# EAGLE design Arduinp-Shield-MicroPunch (EAGLE 9.5.2)
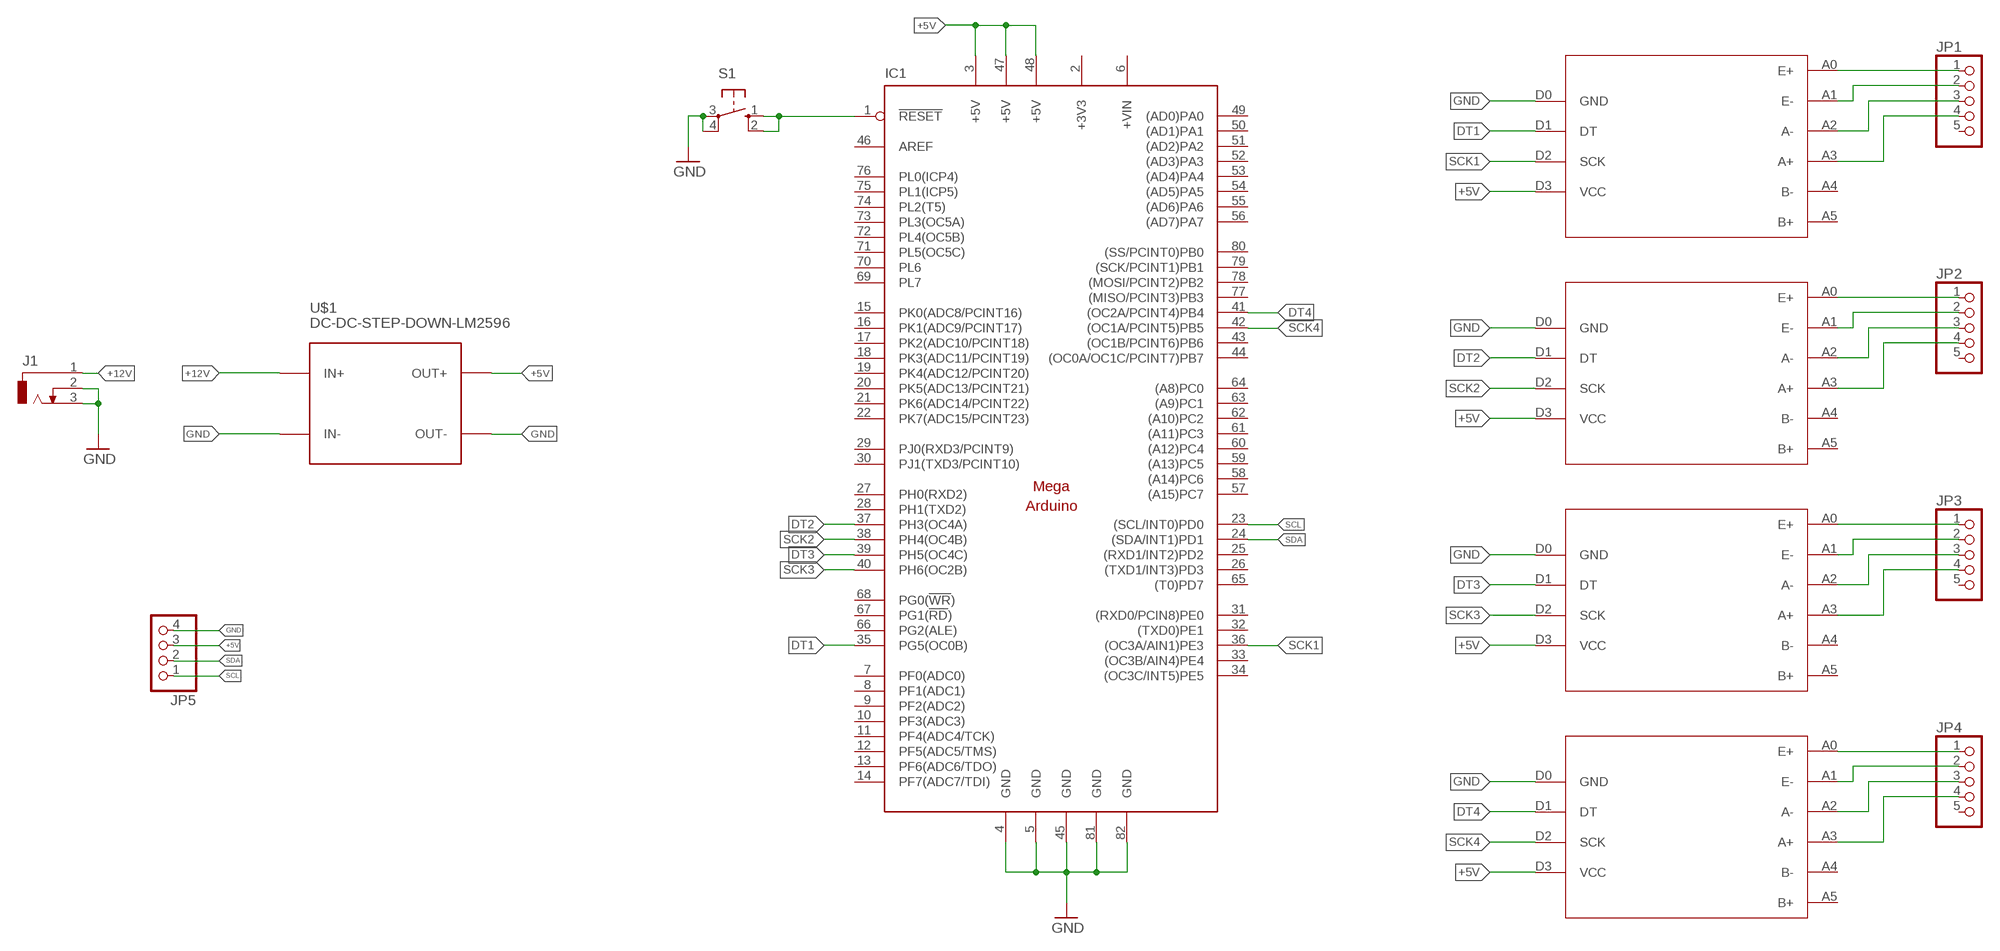
[diagram p0: schematic, sheet 1]

## Parts
IC1  MEGAARDUINO_11  [MEGA_ARDUINO_1]
J1  DCJ0303  [DCJ0303]
JP1  PINHD-1X5  [1X05]
JP2  PINHD-1X5  [1X05]
JP3  PINHD-1X5  [1X05]
JP4  PINHD-1X5  [1X05]
JP5  PINHD-1X4  [1X04]
S1  10-XX  [B3F-10XX]
SM1  HX711  [HX711]
SM2  HX711  [HX711]
SM3  HX711  [HX711]
SM4  HX711  [HX711]
U$1  DC-DC-STEP-DOWN-LM2596  [DC-DC-STEP-DOWN-LM2596]

## Nets
+5V: IC1.3(+5V) IC1.47(+5V) IC1.48(+5V) JP5.3 SM1.D3(VCC) SM2.D3(VCC) SM3.D3(VCC) SM4.D3(VCC) U$1.OUT+
+12V: J1.1 U$1.IN+
DT1: IC1.35(PG5(OC0B)) SM1.D1(DT)
DT2: IC1.37(PH3(OC4A)) SM2.D1(DT)
DT3: IC1.39(PH5(OC4C)) SM3.D1(DT)
DT4: IC1.41((OC2A/PCINT4)PB4) SM4.D1(DT)
GND: IC1.4(GND) IC1.5(GND) IC1.45(GND) IC1.81(GND) IC1.82(GND) J1.2 J1.3 JP5.4 S1.3(P) S1.4(P1) SM1.D0(GND) SM2.D0(GND) SM3.D0(GND) SM4.D0(GND) U$1.IN- U$1.OUT-
N$1: IC1.1(!RESET) S1.1(S) S1.2(S1)
N$17: JP4.1 SM4.A0(E+)
N$18: JP4.2 SM4.A1(E-)
N$19: JP4.3 SM4.A2(A-)
N$20: JP4.4 SM4.A3(A+)
N$21: JP3.1 SM3.A0(E+)
N$22: JP3.2 SM3.A1(E-)
N$23: JP3.3 SM3.A2(A-)
N$24: JP3.4 SM3.A3(A+)
N$25: JP2.1 SM2.A0(E+)
N$26: JP2.2 SM2.A1(E-)
N$27: JP2.3 SM2.A2(A-)
N$28: JP2.4 SM2.A3(A+)
N$29: JP1.1 SM1.A0(E+)
N$30: JP1.2 SM1.A1(E-)
N$31: JP1.3 SM1.A2(A-)
N$32: JP1.4 SM1.A3(A+)
SCK1: IC1.36((OC3A/AIN1)PE3) SM1.D2(SCK)
SCK2: IC1.38(PH4(OC4B)) SM2.D2(SCK)
SCK3: IC1.40(PH6(OC2B)) SM3.D2(SCK)
SCK4: IC1.42((OC1A/PCINT5)PB5) SM4.D2(SCK)
SCL: IC1.23((SCL/INT0)PD0) JP5.1
SDA: IC1.24((SDA/INT1)PD1) JP5.2
Unconnected: IC1.7(PF0(ADC0)) IC1.8(PF1(ADC1)) IC1.9(PF2(ADC2)) IC1.10(PF3(ADC3)) IC1.11(PF4(ADC4/TCK)) IC1.12(PF5(ADC5/TMS)) IC1.13(PF6(ADC6/TDO)) IC1.14(PF7(ADC7/TDI)) IC1.15(PK0(ADC8/PCINT16)) IC1.16(PK1(ADC9/PCINT17)) IC1.17(PK2(ADC10/PCINT18)) IC1.18(PK3(ADC11/PCINT19)) IC1.19(PK4(ADC12/PCINT20)) IC1.20(PK5(ADC13/PCINT21)) IC1.21(PK6(ADC14/PCINT22)) IC1.22(PK7(ADC15/PCINT23)) IC1.25((RXD1/INT2)PD2) IC1.26((TXD1/INT3)PD3) IC1.27(PH0(RXD2)) IC1.28(PH1(TXD2)) IC1.29(PJ0(RXD3/PCINT9)) IC1.30(PJ1(TXD3/PCINT10)) IC1.31((RXD0/PCIN8)PE0) IC1.32((TXD0)PE1) IC1.33((OC3B/AIN4)PE4) IC1.34((OC3C/INT5)PE5) IC1.43((OC1B/PCINT6)PB6) IC1.44((OC0A/OC1C/PCINT7)PB7) IC1.46(AREF) IC1.49((AD0)PA0) IC1.50((AD1)PA1) IC1.51((AD2)PA2) IC1.52((AD3)PA3) IC1.53((AD4)PA4) IC1.54((AD5)PA5) IC1.55((AD6)PA6) IC1.56((AD7)PA7) IC1.57((A15)PC7) IC1.58((A14)PC6) IC1.59((A13)PC5) IC1.60((A12)PC4) IC1.61((A11)PC3) IC1.62((A10)PC2) IC1.63((A9)PC1) IC1.64((A8)PC0) IC1.65((T0)PD7) IC1.66(PG2(ALE)) IC1.67(PG1(!RD!)) IC1.68(PG0(!WR!)) IC1.69(PL7) IC1.70(PL6) IC1.71(PL5(OC5C)) IC1.72(PL4(OC5B)) IC1.73(PL3(OC5A)) IC1.74(PL2(T5)) IC1.75(PL1(ICP5)) IC1.76(PL0(ICP4)) IC1.77((MISO/PCINT3)PB3) IC1.78((MOSI/PCINT2)PB2) IC1.79((SCK/PCINT1)PB1) IC1.80((SS/PCINT0)PB0) JP1.5 JP2.5 JP3.5 JP4.5 SM1.A4(B-) SM1.A5(B+) SM2.A4(B-) SM2.A5(B+) SM3.A4(B-) SM3.A5(B+) SM4.A4(B-) SM4.A5(B+)

## Power pins joined to a net without a drawn wire
+3V3: IC1.2(+3V3)
+VIN: IC1.6(+VIN)

## Library data of the parts
IC1 = arduino:MEGAARDUINO_1: The Arduino Mega is a microcontroller board based on the ATmega1280. - 54 digital input/output pins (of which 14 can be used as PWM outputs) - 16 analog inputs - 4 UARTs (hardware serial ports) - 16 MHz crystal oscillator - USB connection - power jack - ICSP header - reset button It contains everything needed to support the microcontroller; simply connect it to a computer with a USB cable or power it with a AC-to-DC adapter or battery to get started. The Mega is compatible with most shields designed for the Arduino Duemilanove or Diecimila. http://arduino.cc/en/Main/ArduinoBoardMega
J1 = con-jack:DCJ0303: DC POWER JACK Source: DCJ0303.pdf; OC_FARNELL: unknown; OC_NEWARK: unknown
JP1-JP4 = pinhead:PINHD-1X5: PIN HEADER
JP5 = pinhead:PINHD-1X4: PIN HEADER
S1 = switch-omron:10-XX: OMRON SWITCH; MPN: B3F-1000; OC_FARNELL: 176432; OC_NEWARK: 36M3542
SM1-SM4 = hx711:HX711: HX711 module is a Load Cell Amplifier breakout board for the HX711 IC that allows you to easily read load cells to measure weight. This module uses 24 high precision A/D converter chip HX711. It is a specially designed for the high precision electronic scale design, with two analog input channel, the internal integration of 128 times the programmable gain amplifier. The input circuit can be configured to provide a bridge type pressure bridge (such as pressure, weighing sensor mode), is of high precision, low cost is an ideal sampling front-end module.
U$1 = diy-modules:DC-DC-STEP-DOWN-LM2596: DC/DC Step-Down Regulator based on LM2596-ADJ chip LM2596 datasheet available here: http://www.ti.com/lit/ds/symlink/lm2596.pdf Click here to find device on ebay.com <http://www.ebay.com/sch/lm2596+power+regulator>

## Board
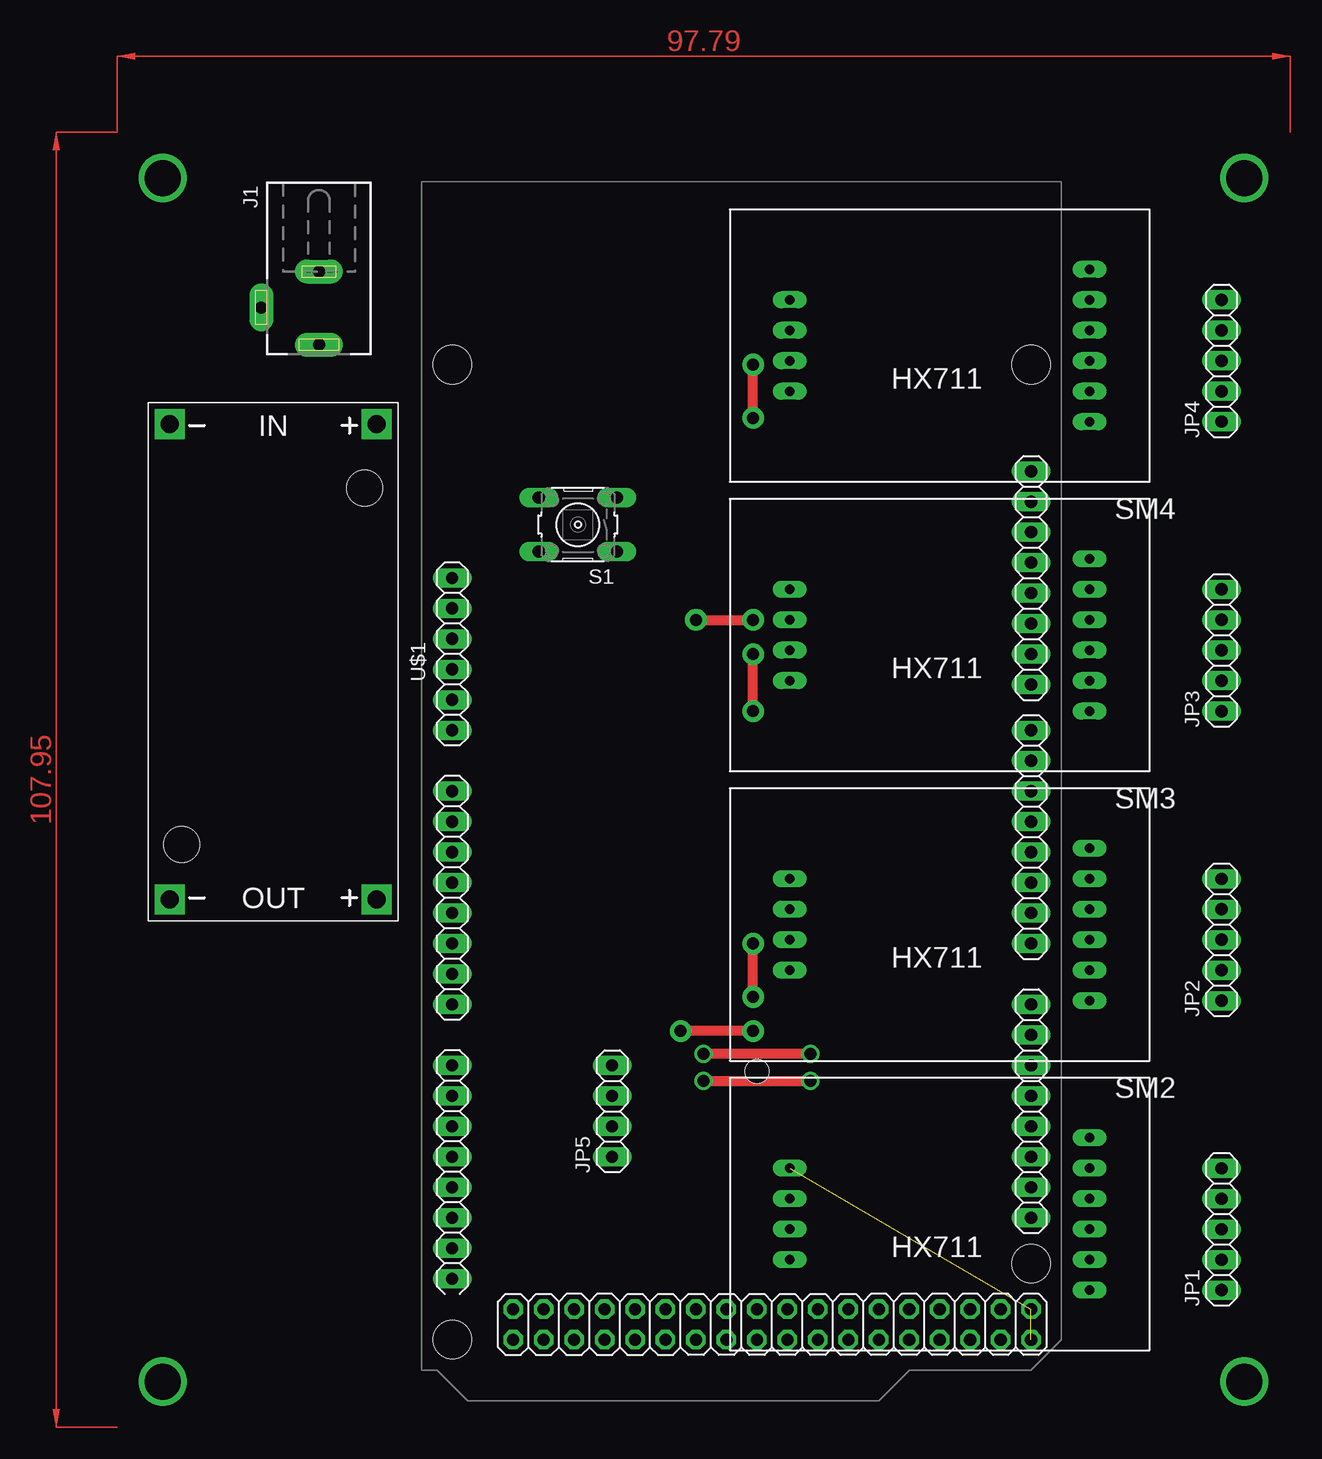
[diagram p1: board, top side]
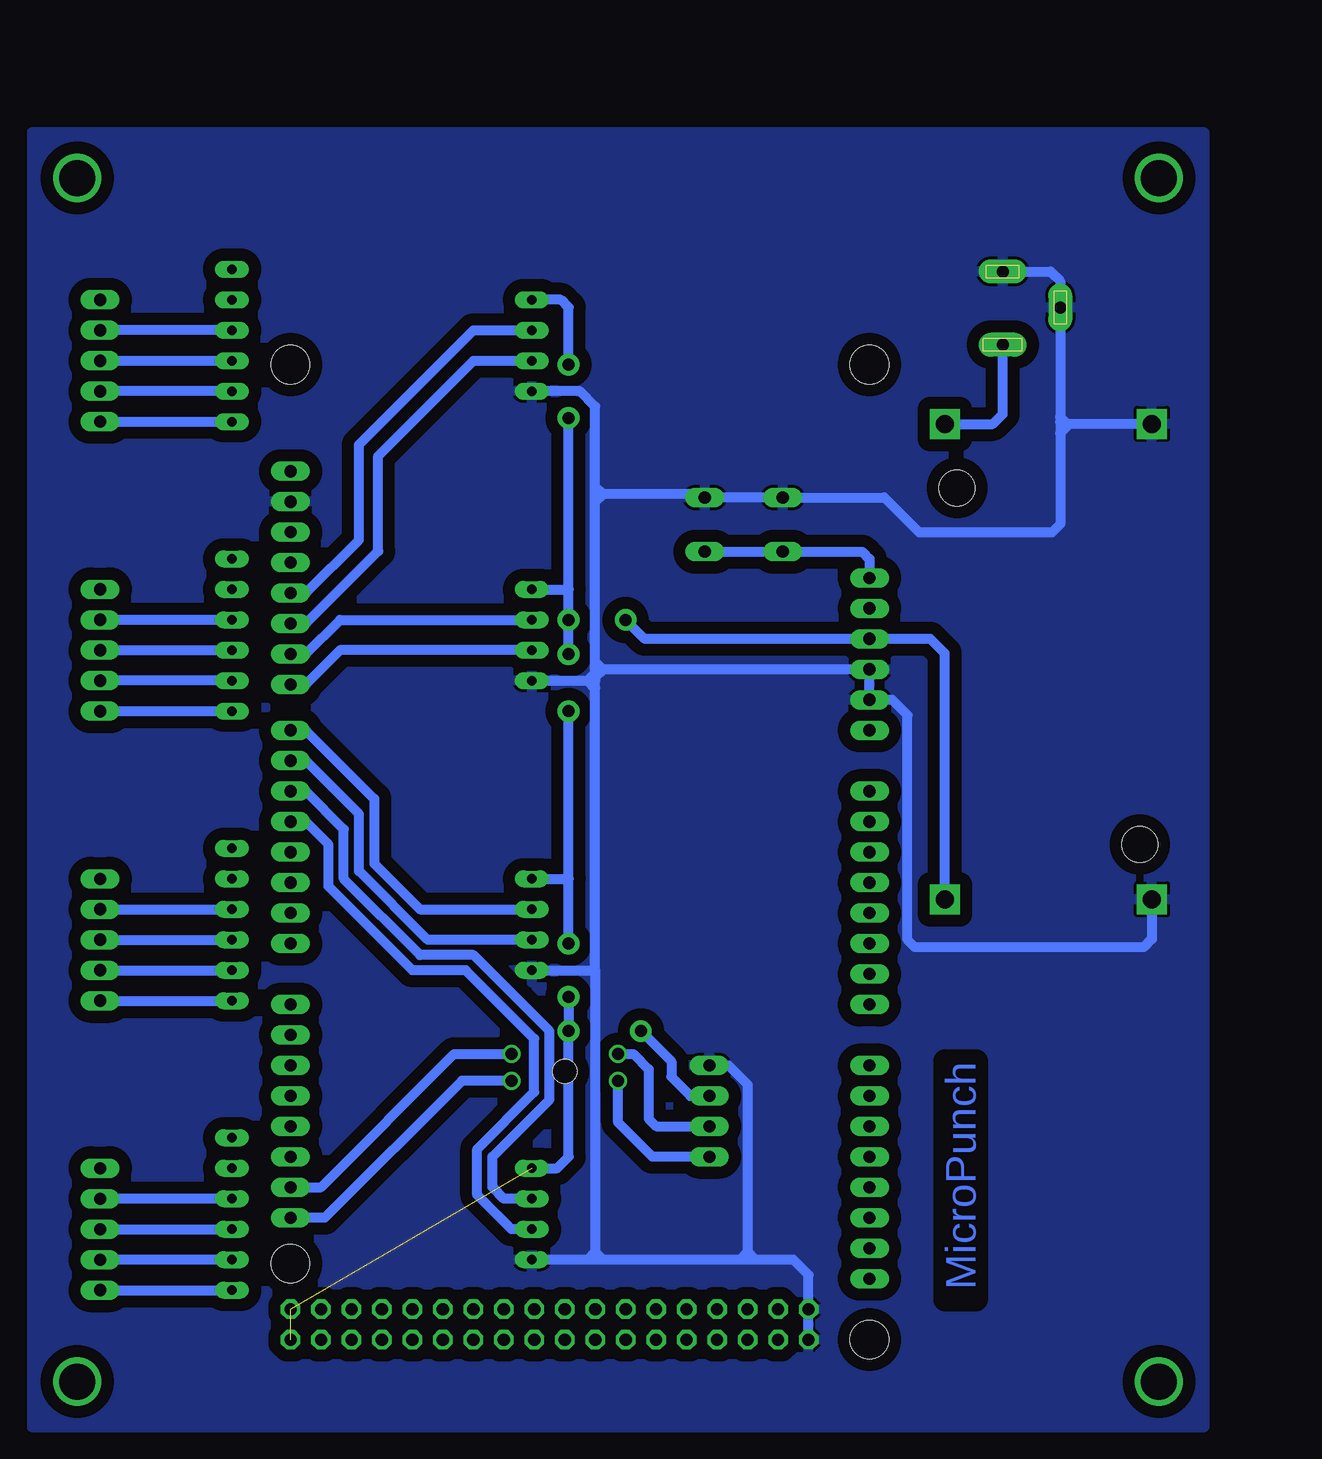
[diagram p2: board, bottom side, seen from below]

No outline drawn. Coordinates in mm, seen from the top.
Copper layers (1*16): Top 0.035mm / dielectric 1.5mm / Bottom 0.035mm
Design rules "default *": minimum track width 6mil, minimum drill 0.35mm, track to track 6mil, track to pad 6mil, pad to pad 6mil, via to via 6mil, smd to smd 6mil, copper to edge 40mil, drill to drill 6mil, minimum pad ring 12mil, minimum via ring 8mil, stop-mask expansion 4mil, vias tented up to drill 0mil, thermal gap 10mil

### Footprints (pad centres in the part's own frame; a part is rotated, then mirrored left to right if it is on the bottom)
MEGA_ARDUINO_1 = drill 1.016 long: 1 33.02,2.54; 2 35.56,2.54; 3 38.1,2.54; 4 40.64,2.54; 5 43.18,2.54; 6 45.72,2.54; 7 50.8,2.54; 8 53.34,2.54; 9 55.88,2.54; 10 58.42,2.54; 11 60.96,2.54; 12 63.5,2.54; 13 66.04,2.54; 14 68.58,2.54; 15 73.66,2.54; 16 76.2,2.54; 17 78.74,2.54; 18 81.28,2.54; 19 83.82,2.54; 20 86.36,2.54; 21 88.9,2.54; 22 91.44,2.54; 23 86.36,50.8; 24 83.82,50.8; 25 81.28,50.8; 26 78.74,50.8; 27 76.2,50.8; 28 73.66,50.8; 29 71.12,50.8; 30 68.58,50.8; 31 63.5,50.8; 32 60.96,50.8; 33 58.42,50.8; 34 55.88,50.8; 35 53.34,50.8; 36 50.8,50.8; 37 48.26,50.8; 38 45.72,50.8; 39 41.91,50.8; 40 39.37,50.8; 41 36.83,50.8; 42 34.29,50.8; 43 31.75,50.8; 44 29.21,50.8; 45 26.67,50.8; 46 24.13,50.8 | drill 1.016 octagon: 47 93.98,50.8; 48 96.52,50.8; 49 93.98,48.26; 50 96.52,48.26; 51 93.98,45.72; 52 96.52,45.72; 53 93.98,43.18; 54 96.52,43.18; 55 93.98,40.64; 56 96.52,40.64; 57 93.98,38.1; 58 96.52,38.1; 59 93.98,35.56; 60 96.52,35.56; 61 93.98,33.02; 62 96.52,33.02; 63 93.98,30.48; 64 96.52,30.48; 65 93.98,27.94; 66 96.52,27.94; 67 93.98,25.4; 68 96.52,25.4; 69 93.98,22.86; 70 96.52,22.86; 71 93.98,20.32; 72 96.52,20.32; 73 93.98,17.78; 74 96.52,17.78; 75 93.98,15.24; 76 96.52,15.24; 77 93.98,12.7; 78 96.52,12.7; 79 93.98,10.16; 80 96.52,10.16; 81 93.98,7.62; 82 96.52,7.62 | hole 3.2: 15.24,50.8; 15.24,2.54; 90.17,50.8; 96.52,2.54 | hole 2: 74.168,27.94
DCJ0303 = drill 1 pad 2 long: 1 0,3.1; 2 4.8,0; 3 0,-3
1X05 = drill 1.016 long: 1 -5.08,0; 2 -2.54,0; 3 0,0; 4 2.54,0; 5 5.08,0
1X04 = drill 1.016 long: 1 -3.81,0; 2 -1.27,0; 3 1.27,0; 4 3.81,0
B3F-10XX = drill 1.016 long: 1 -3.251,2.261; 2 3.251,2.261; 3 -3.251,-2.261; 4 3.251,-2.261
HX711 = drill 0.8 long: A0 -12.5,6.35; A1 -12.5,3.81; A2 -12.5,1.27; A3 -12.5,-1.27; A4 -12.5,-3.81; A5 -12.5,-6.35; D0 12.5,3.81; D1 12.5,1.27; D2 12.5,-1.27; D3 12.5,-3.81
DC-DC-STEP-DOWN-LM2596 = drill 1.5 pad 2.5 square: IN+ -19.812,8.636; IN- -19.812,-8.636; OUT+ 19.812,8.636; OUT- 19.812,-8.636 | hole 3: -14.478,7.62; 15.24,-7.62

### Placement (x,y rotation side)
IC1  52.07,79.69 270 top
J1  43.5,69.22 180 top
JP1  118.75,-7.62 90 top
JP2  118.75,16.51 90 top
JP3  118.75,40.64 90 top
JP4  118.75,64.77 90 top
JP5  67.94,2.22 90 top
S1  65.09,51.12 180 top
SM1  95.25,-6.35 180 top
SM2  95.25,17.78 180 top
SM3  95.25,41.91 180 top
SM4  95.25,66.04 180 top
U$1  39.69,39.69 270 top

### Tracks (layer width: path | path; a pad name or v marks a point on that pad's centre or on a via)
+5V  (via drill 1 pad 1.8)  (2 unrouted)
  Top 0.813: v79.69,11.75 v79.69,16.19 | v79.69,35.56 v79.69,40.32 | v79.69,60.01 v79.69,64.45 | v74.93,43.18 v79.69,43.18 | v79.69,8.89 v73.66,8.89
  Bottom 0.813: SM1.D3 80.64,-2.54 79.69,-1.59 v79.69,8.89 v79.69,11.75 | v79.69,16.19 79.69,21.59 | 79.69,21.59 v79.69,35.56 | v79.69,40.32 v79.69,43.18 79.69,45.72 | 79.69,45.72 v79.69,60.01 | v79.69,64.45 79.69,69.22 80.33,69.85 SM4.D3 | SM3.D3 79.69,45.72 | SM2.D3 79.69,21.59 | v74.93,43.18 73.34,41.59 IC1.3 49.53,41.59 48.32,40.39 U$1.OUT+ | JP5.3 69.53,3.49 71.12,5.08 71.12,6.35 v73.66,8.89
+12V
  Bottom 0.813: U$1.IN+ 44.32,59.5 43.5,60.33 J1.1
DT1
  Bottom 0.813: SM1.D1 84.45,-7.62 87.31,-4.76 87.31,-0.95 82.55,3.81 82.55,8.26 88.27,13.97 92.71,13.97 99.69,20.95 99.69,24.45 101.6,26.35 IC1.35
DT2
  Bottom 0.813: SM2.D1 91.44,16.51 97.16,22.23 97.16,26.99 101.6,31.43 IC1.37
DT3
  Bottom 0.813: SM3.D1 98.74,40.64 101.6,37.78 IC1.39
DT4
  Bottom 0.813: IC1.41 101.6,42.86 95.57,48.9 95.57,56.83 87.63,64.77 SM4.D1
GND
  Bottom 0.813: 77.47,13.97 77.47,37.47 | 77.47,37.47 77.47,38.1 | 77.47,38.42 77.47,38.73 | 77.47,38.73 77.47,39.05 | 77.47,39.05 77.47,39.69 | 77.47,39.69 77.47,53.02 | 77.47,53.02 77.47,53.66 | 77.47,53.66 77.47,54.29 | 77.47,54.29 77.47,60.96 78.74,62.23 SM4.D0 | SM3.D0 78.11,38.1 | 78.11,38.1 77.47,38.1 | SM2.D0 77.47,13.97 | 77.47,-10.16 78.11,-10.16 | 78.11,-10.16 SM1.D0 | 77.47,13.97 77.47,-9.53 | 77.47,-9.53 77.47,-10.16 | 76.83,39.05 IC1.4 IC1.5 52.7,36.51 51.44,35.24 51.44,16.51 50.8,15.88 31.75,15.88 31.05,16.57 U$1.OUT- | 76.83,39.05 77.47,39.05 | 77.47,38.73 78.11,38.1 | 76.83,39.05 77.47,38.42 | 77.47,38.42 77.47,38.1 | 77.47,39.69 76.83,39.05 | 78.11,38.1 77.47,37.47 | 76.83,53.66 68.62,53.66 S1.3 S1.4 53.38,53.38 50.48,50.48 39.37,50.48 38.7,51.16 38.7,58.74 | 77.47,53.66 76.83,53.66 | 76.83,53.66 77.47,54.29 | 76.83,53.66 77.47,53.02 | J1.3 39.51,72.22 38.7,71.4 J1.2 38.7,60.1 | 38.7,60.1 38.7,59.69 | 38.7,59.69 38.7,58.74 | U$1.IN- 38.1,59.5 | 38.1,59.5 38.51,59.5 38.7,59.69 | 38.1,59.5 38.7,60.1 | 38.1,59.5 38.1,59.34 38.7,58.74 | IC1.82 IC1.81 59.69,-11.43 60.96,-10.16 64.14,-10.16 | 64.14,-10.16 64.77,-10.16 | 64.77,-10.16 65.41,-10.16 | 65.41,-10.16 76.83,-10.16 | 76.83,-10.16 77.47,-10.16 | JP5.4 66.36,6.03 64.77,4.45 64.77,-9.53 | 64.77,-9.53 64.77,-10.16 | 65.41,-10.16 64.77,-9.53 | 64.14,-10.16 64.77,-9.53 | 78.11,-10.16 77.47,-9.53 | 76.83,-10.16 77.47,-9.53
  pour Bottom (isolate 1.016): 26.67,83.82 124.46,83.82 124.46,-24.13 26.67,-24.13
N$1
  Bottom 0.813: S1.1 S1.2 55.21,48.86 54.61,48.26 IC1.1
N$2  (via drill 3 pad 4)
  other vias: 30.48,80.01
N$3  (via drill 3 pad 4)
  other vias: 120.65,80.01
N$4  (via drill 3 pad 4)
  other vias: 120.65,-20.32
N$5  (via drill 3 pad 4)
  other vias: 30.48,-20.32
N$17
  Bottom 0.813: JP4.1 SM4.A0
N$18
  Bottom 0.813: SM4.A1 JP4.2
N$19
  Bottom 0.813: JP4.3 SM4.A2
N$20
  Bottom 0.813: SM4.A3 JP4.4
N$21
  Bottom 0.813: JP3.1 SM3.A0
N$22
  Bottom 0.813: SM3.A1 JP3.2
N$23
  Bottom 0.813: JP3.3 SM3.A2
N$24
  Bottom 0.813: SM3.A3 JP3.4
N$25
  Bottom 0.813: JP2.1 SM2.A0
N$26
  Bottom 0.813: JP2.2 SM2.A1
N$27
  Bottom 0.813: JP2.3 SM2.A2
N$28
  Bottom 0.813: JP2.4 SM2.A3
N$29
  Bottom 0.813: JP1.1 SM1.A0
N$30
  Bottom 0.813: SM1.A1 JP1.2
N$31
  Bottom 0.813: JP1.3 SM1.A2
N$32
  Bottom 0.813: SM1.A3 JP1.4
SCK1
  Bottom 0.813: SM1.D2 85.09,-5.08 86.04,-4.13 86.04,-1.59 81.28,3.17 81.28,8.89 87.63,15.24 92.08,15.24 98.42,21.59 98.42,25.72 101.6,28.89 IC1.36
SCK2
  Bottom 0.813: IC1.38 101.6,33.97 95.89,28.26 95.89,22.86 92.08,19.05 SM2.D2
SCK3
  Bottom 0.813: IC1.40 101.6,40.32 98.74,43.18 SM3.D2
SCK4
  Bottom 0.813: IC1.42 101.6,45.4 97.16,49.85 97.16,57.78 87.63,67.31 SM4.D2
SCL  (via drill 1)
  Top 0.813: v75.56,4.76 v84.45,4.76
  Bottom 0.813: JP5.1 72.71,-1.59 75.56,1.27 v75.56,4.76 | v84.45,4.76 88.58,4.76 100.01,-6.67 IC1.23
SDA  (via drill 1)
  Top 0.813: v84.45,6.99 v75.56,6.99
  Bottom 0.813: IC1.24 100.33,-4.13 89.22,6.99 v84.45,6.99 | v75.56,6.99 74.3,6.99 73.03,5.71 73.03,1.59 72.39,0.95 JP5.2
(copper drawn outside any net)
  shapes: Top area x2

### Text on the board
Bottom: MicroPunch